# EasyEDA Pro project PCB.eprj

# Schematic Schematics
Create Date: 2023-04-09; Page Name: Schematic; Project Name: PCB; Schematic Name: Schematics; Update Date: 2023-04-09; Drawed: Keith Wong; Page Size: A4; Version: V1.0
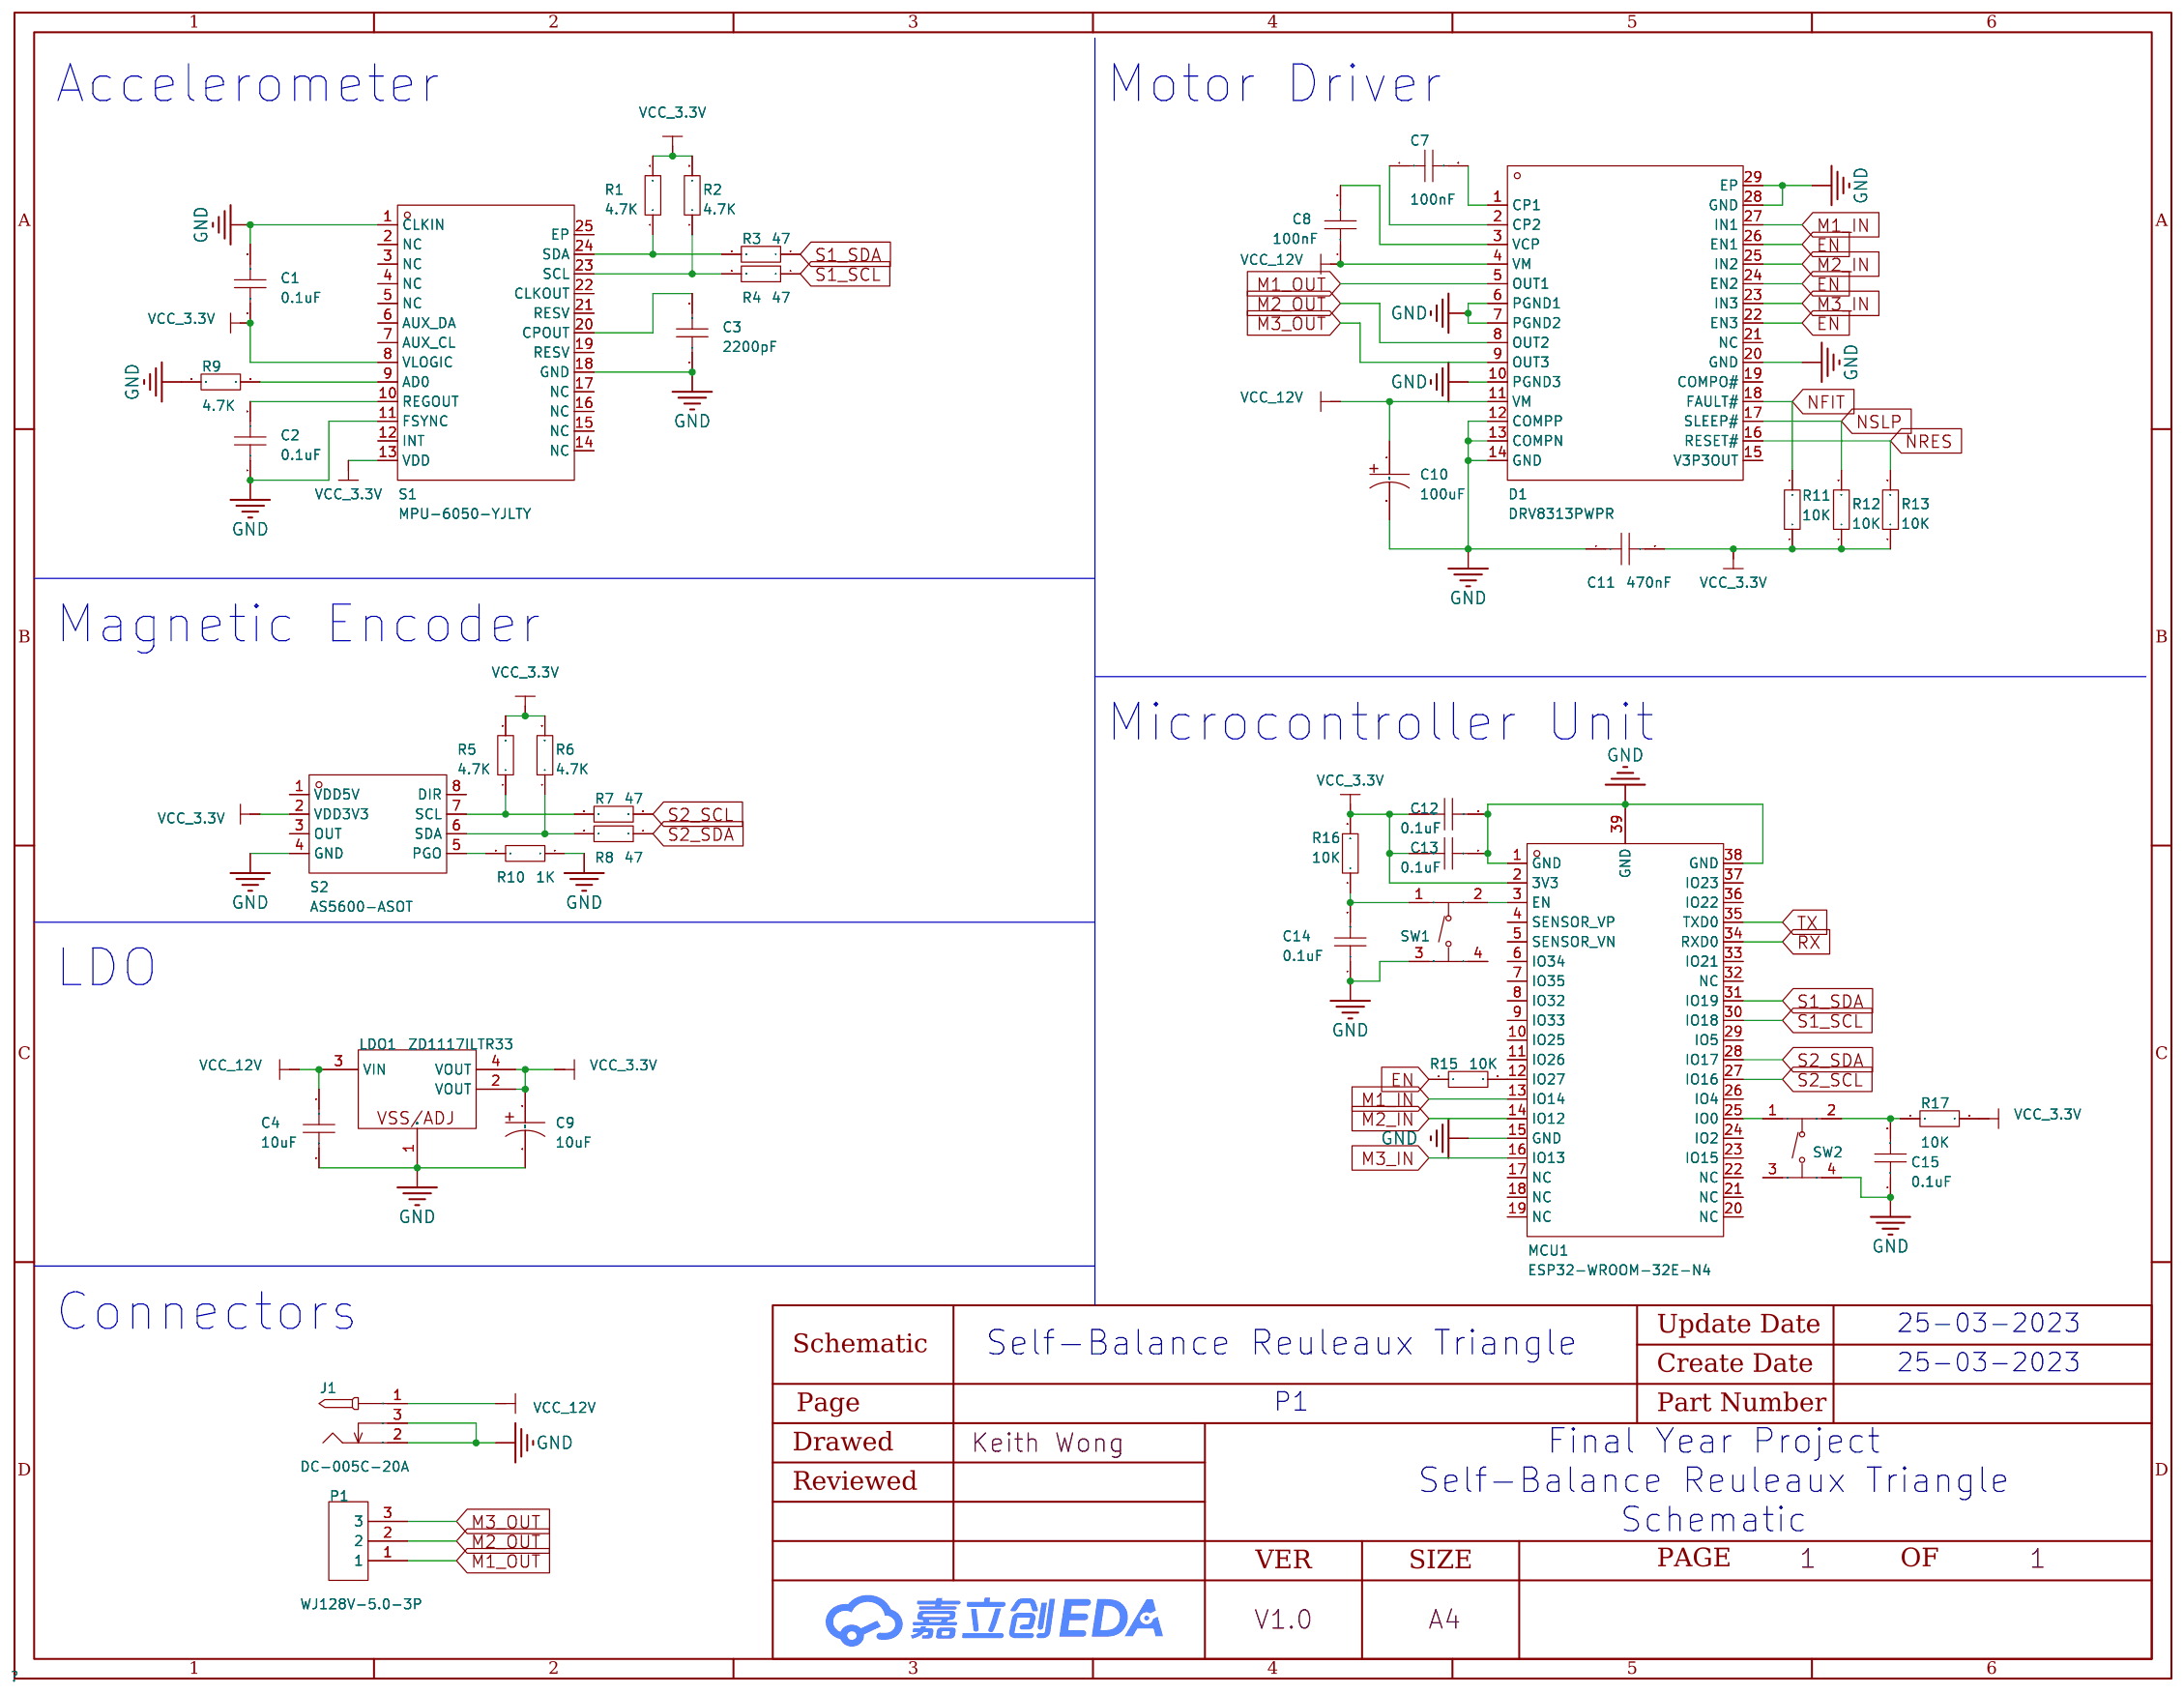
[diagram p0: schematic sheet]

## Parts
C1  0.1uF  [C0603]
C2  0.1uF  [C0603]
C3  2200pF  [C0603]
C4  10uF  [C0603]
C7  100nF  [C0603]
C8  100nF  [C0603]
C9  10uF  [CAP-SMD_BD6.3-L6.6-W6.6-FD]
C10  100uF  [CAP-SMD_BD6.3-L6.6-W6.6-FD]
C11  470nF  [C0603]
C12  0.1uF  [C0603]
C13  0.1uF  [C0603]
C14  0.1uF  [C0603]
C15  0.1uF  [C0603]
D1  DRV8313PWPR  [HTSSOP-28_L9.8-W4.5-P0.65-LS6.6-BL-EP]
J1  DC-005C-20A  [DC-IN-TH_DC-005C-20A]
LDO1  ZD1117ILTR33  [SOT-223-4_L6.5-W3.5-P2.30-LS7.0-BR]
MCU1  ESP32-WROOM-32E-N4  [WIFI-SMD_ESP32-WROOM-32E]
P1  WJ128V-5.0-3P  [CONN-TH_3P-P5.00_WJ128V-5.0-3P]
R1  4.7K  [R0603]
R2  4.7K  [R0603]
R3  47  [R0603]
R4  47  [R0603]
R5  4.7K  [R0603]
R6  4.7K  [R0603]
R7  47  [R0603]
R8  47  [R0603]
R9  4.7K  [R0603]
R10  1K  [R0603]
R11  10K  [R0603]
R12  10K  [R0603]
R13  10K  [R0603]
R15  10K  [R0603]
R16  10K  [R0603]
R17  10K  [R0603]
S1  MPU-6050-YJLTY  [QFN-24_L4.0-W4.0-P0.50-TL-EP2.7]
S2  AS5600-ASOT  [SOIC-8_L5.0-W4.0-P1.27-LS6.0-BL]
SW1  TS-1187A-B-A-B  [SW-SMD_4P-L5.1-W5.1-P3.70-LS6.5-TL-2]
SW2  TS-1187A-B-A-B  [SW-SMD_4P-L5.1-W5.1-P3.70-LS6.5-TL-2]

## Library data of the parts
C1-C4 C7 C8 C11-C15 = CAP_0603: Supplier Footprint: 0603
C9 C10 = 47uF-SMD,6.3*5.4mm: Supplier Part: C9900020202; JLCPCB Part Class: Extended Part; Datasheet: https://atta.szlcsc.comnull; Supplier: LCSC
D1 = DRV8313PWPR: DRV8313 三路 1/2 H 桥驱动器 IC; Supplier Part: C92482; Manufacturer: TI(德州仪器); Supplier Footprint: HTSSOP-28; JLCPCB Part Class: Extended Part; Datasheet: https://atta.szlcsc.com/upload/public/pdf/source/20180307/C92482_15204091381071407760.pdf; Supplier: LCSC
J1 = DC-005C-20A: 触点内径:2mm;触点外径:6.4mm;额定电流:3A;额定电压:24V;; LCSC Part Name: 内径:2mm 外径:6.4mm 高品质; Supplier Part: C84007; Manufacturer: 韩国韩荣; Supplier Footprint: 插件; JLCPCB Part Class: Extended Part; Datasheet: https://atta.szlcsc.com/upload/public/pdf/source/20210810/A9F07BBB960FE584CB8DE17AFB8953D7.pdf; Supplier: LCSC; Inside Contact Diameter: 2mm; Outside Contact Diameter: 6.4mm; Current Rating (Max): 3A; Voltage Rating (Max): 24V
LDO1 = ZD1117ILTR33: 输出类型:-;输出极性:正;输出通道数:1;最大输入电压:18V;输出电压:3.3V;压差:1.3V;静态电流(地电流):2mA;输出电流:1A;电源纹波抑制比(PSRR):-;噪声:-;特性:-;工作温度:-40℃~+85℃;; LCSC Part Name: 正 Vin=18V Vout=3.3V 1A; Supplier Part: C2928930; Manufacturer: Zetta(澜智); Supplier Footprint: SOT-223-4; JLCPCB Part Class: Extended Part; Datasheet: https://atta.szlcsc.com/upload/public/pdf/source/20211228/8A2F6B482059197F37036E6E4099FB94.pdf; Supplier: LCSC; Output Polarity: 正; Number of Outputs: 1; Maximum Input Voltage: 18V; Output Voltage: 3.3V; Dropout Voltage: 1.3V; Quiescent Current (Ground Current): 2mA; Output Current: 1A; Operating Temperature: -40℃~+85℃
MCU1 = ESP32-WROOM-32E-N4_C701341: ESP32-WROOM-32E 集成 ESP32-D0WD-V3 芯片，具有?高的稳定性和安全性能。; LCSC Part Name: WIFI模块 PCB板载天线模组; Supplier Part: C701341; Manufacturer: ESPRESSIF(乐鑫); Supplier Footprint: SMD,18x25.5mm; JLCPCB Part Class: Extended Part; Datasheet: https://atta.szlcsc.com/upload/public/pdf/source/20220601/0020821B65DE5740BBACA5FACC5CF3B6.pdf; Supplier: LCSC
P1 = WJ128V-5.0-3P: 间距:5mm;排数:1;每排PIN数:3;安装方式:直针;额定电流:20A;额定电压:250V;线规 - AWG:12~22;线规 - mm?:2.5;工作温度范围:-40℃~+105℃;颜色:绿色;; LCSC Part Name: 5mm 排数:1 每排P数:3 直针 可拼接; Supplier Part: C8270; Manufacturer: KANGNEX(康奈克斯电气); Supplier Footprint: 直插,P=5mm; JLCPCB Part Class: Extended Part; Datasheet: https://atta.szlcsc.com/upload/public/pdf/source/20191225/C8270_68EE597E4523D77F257225C74F324861.pdf; Supplier: LCSC; Pitch: 5mm; Number of Rows: 1; Number of PINs Per Row: 3; Mounting Style: 直针; Current Rating (Max): 20A; Voltage Rating (Max): 250V; Wire Gauge - AWG: 12~22; Wire Gauge - mm?: 2.5; Operating Temperature Range: -40℃~+105℃; Color: 绿色
R1-R13 R15-R17 = Res_0603: Supplier Footprint: 0603
S1 = MPU-6050-YJLTY: Supplier Part: C9900004367; Supplier Footprint: QFN-24_L4.0-W4.0-P0.50-EP2.7; JLCPCB Part Class: Extended Part; Supplier: LCSC
S2 = AS5600-ASOT: Supplier Part: C499458; Manufacturer: ams(艾迈斯半导体); Supplier Footprint: SOIC-8; JLCPCB Part Class: Extended Part; Datasheet: https://atta.szlcsc.com/upload/public/pdf/source/20200324/C499458_E1461AFB0CE1042DE5756821C534625C.pdf; Supplier: LCSC
SW1 SW2 = TS-1187A-B-A-B: 触点电流:50mA;额定电压(DC):12V;绝缘电阻:100mΩ;电路结构:单刀单掷;安装方式:立贴;按钮形状:圆形按钮;按钮/盖帽颜色:金色;带灯:无;作用力:160gf;机械寿命:100000;工作温度:-30℃~+85℃;开关长度:5.1mm;开关宽度:5.1mm;开关高度:1.5mm;带支架:无;; LCSC Part Name: 轻触开关 5.1*5.1*1.5贴片 防水金属头160gf; Supplier Part: C318884; Manufacturer: XKB Connectivity(中国星坤); Supplier Footprint: SMD; JLCPCB Part Class: Basic Part; Datasheet: https://atta.szlcsc.com/upload/public/pdf/source/20200227/C318884_1F20165719E1C4CAA3E10C4C359C6E26.pdf; Supplier: LCSC; Contact Current: 50mA; Voltage Rating (DC): 12V; Insulation Resistance: 100mΩ; Circuit: 单刀单掷; Mounting Style: 立贴; Actuator Style: 圆形按钮; Actuator/Cap Color: 金色; With Lamp: 无; Operating Force: 160gf; Mechanical Life: 100000; Operating Temperature: -30℃~+85℃; Switch Length: 5.1mm; Switch Width: 5.1mm; Switch Height: 1.5mm; Strike Gundam: 无

## Nets
GND: C1.2 C2.1 C3.1 C4.2 C9.2 C10.2 C11.1 C12.2 C13.2 C14.1 C15.1 D1.6(PGND1) D1.7(PGND2) D1.10(PGND3) D1.12(COMPP) D1.13(COMPN) D1.14(GND) D1.20(GND) D1.28(GND) D1.29(EP) J1.2 J1.3 LDO1.1(VSS/ADJ) MCU1.1(GND) MCU1.15(GND) MCU1.38(GND) MCU1.39(GND) R9.1 R10.1 S1.1(CLKIN) S1.11(FSYNC) S1.18(GND) S2.4(GND) SW1.3(C) SW2.4(D)
VCC_3.3V: C1.1 C9.1 C11.2 C12.1 C13.1 LDO1.2(VOUT) LDO1.4(VOUT) MCU1.2(3V3) R1.2 R2.2 R5.2 R6.2 R11.1 R12.1 R13.1 R16.2 R17.2 S1.8(VLOGIC) S1.13(VDD) S2.2(VDD3V3)
VCC_12V: C4.1 C8.1 C10.1 D1.4(VM) D1.11(VM) J1.1 LDO1.3(VIN)
EN: D1.22(EN3) D1.24(EN2) D1.26(EN1) R15.1
M1_IN: D1.27(IN1) MCU1.13(IO14)
M1_OUT: D1.5(OUT1) P1.1
M2_IN: D1.25(IN2) MCU1.14(IO12)
M2_OUT: D1.8(OUT2) P1.2
M3_IN: D1.23(IN3) MCU1.16(IO13)
M3_OUT: D1.9(OUT3) P1.3
NFIT: D1.18(FAULT#) R11.2
NRES: D1.16(RESET#) R13.2
NSLP: D1.17(SLEEP#) R12.2
RX: MCU1.34(RXD0)
S1_SCL: MCU1.30(IO18) R4.1
S1_SDA: MCU1.31(IO19) R3.1
S2_SCL: MCU1.27(IO16) R7.1
S2_SDA: MCU1.28(IO17) R8.1
TX: MCU1.35(TXD0)
$1N1534: R5.1 R7.2 S2.7(SCL)
$1N1538: R6.1 R8.2 S2.6(SDA)
$1N2187: R10.2 S2.5(PGO)
$1N2532: C7.2 D1.1(CP1)
$1N2537: C7.1 D1.2(CP2)
$1N2541: C8.2 D1.3(VCP)
$1N3829: MCU1.12(IO27) R15.2
$1N3990: MCU1.3(EN) SW1.2(B)
$1N4114: C14.2 R16.1 SW1.1(A)
$1N4239: C15.2 R17.1 SW2.2(B)
$1N4243: MCU1.25(IO0) SW2.1(A)
Net-(C2-2): C2.2 S1.10(REGOUT)
Net-(C3-2): C3.2 S1.20(CPOUT)
Net-(R1-1): R1.1 R3.2 S1.24(SDA)
Net-(R2-1): R2.1 R4.2 S1.23(SCL)
Net-(R9-2): R9.2 S1.9(AD0)

Not connected (* = marked no-connect by the designer): D1 15(V3P3OUT) 19(COMPO#) 21(NC); MCU1 4(SENSOR_VP) 5(SENSOR_VN) 6(IO34) 7(IO35) 8(IO32) 9(IO33) 10(IO25) 11(IO26) 17(NC) 18(NC) 19(NC) 20(NC) 21(NC) 22(NC) 23(IO15) 24(IO2) 26(IO4) 29(IO5) 32(NC) 33(IO21) 36(IO22) 37(IO23); S1 2(NC) 3(NC) 4(NC) 5(NC) 6(AUX_DA) 7(AUX_CL) 12(INT) 14(NC) 15(NC) 16(NC) 17(NC) 19(RESV) 21(RESV) 22(CLKOUT) 25(EP); S2 1(VDD5V) 3(OUT) 8(DIR); SW1 4(D); SW2 3(C)

## Notes on the sheet
- Accelerometer
- Motor Driver
- Magnetic Encoder
- Microcontroller Unit
- LDO
- Connectors
- 25-03-2023
- Self-Balance Reuleaux Triangle
- 25-03-2023
- P1
- Final Year Project
- Self-Balance Reuleaux Triangle
- Schematic

# Board PCB
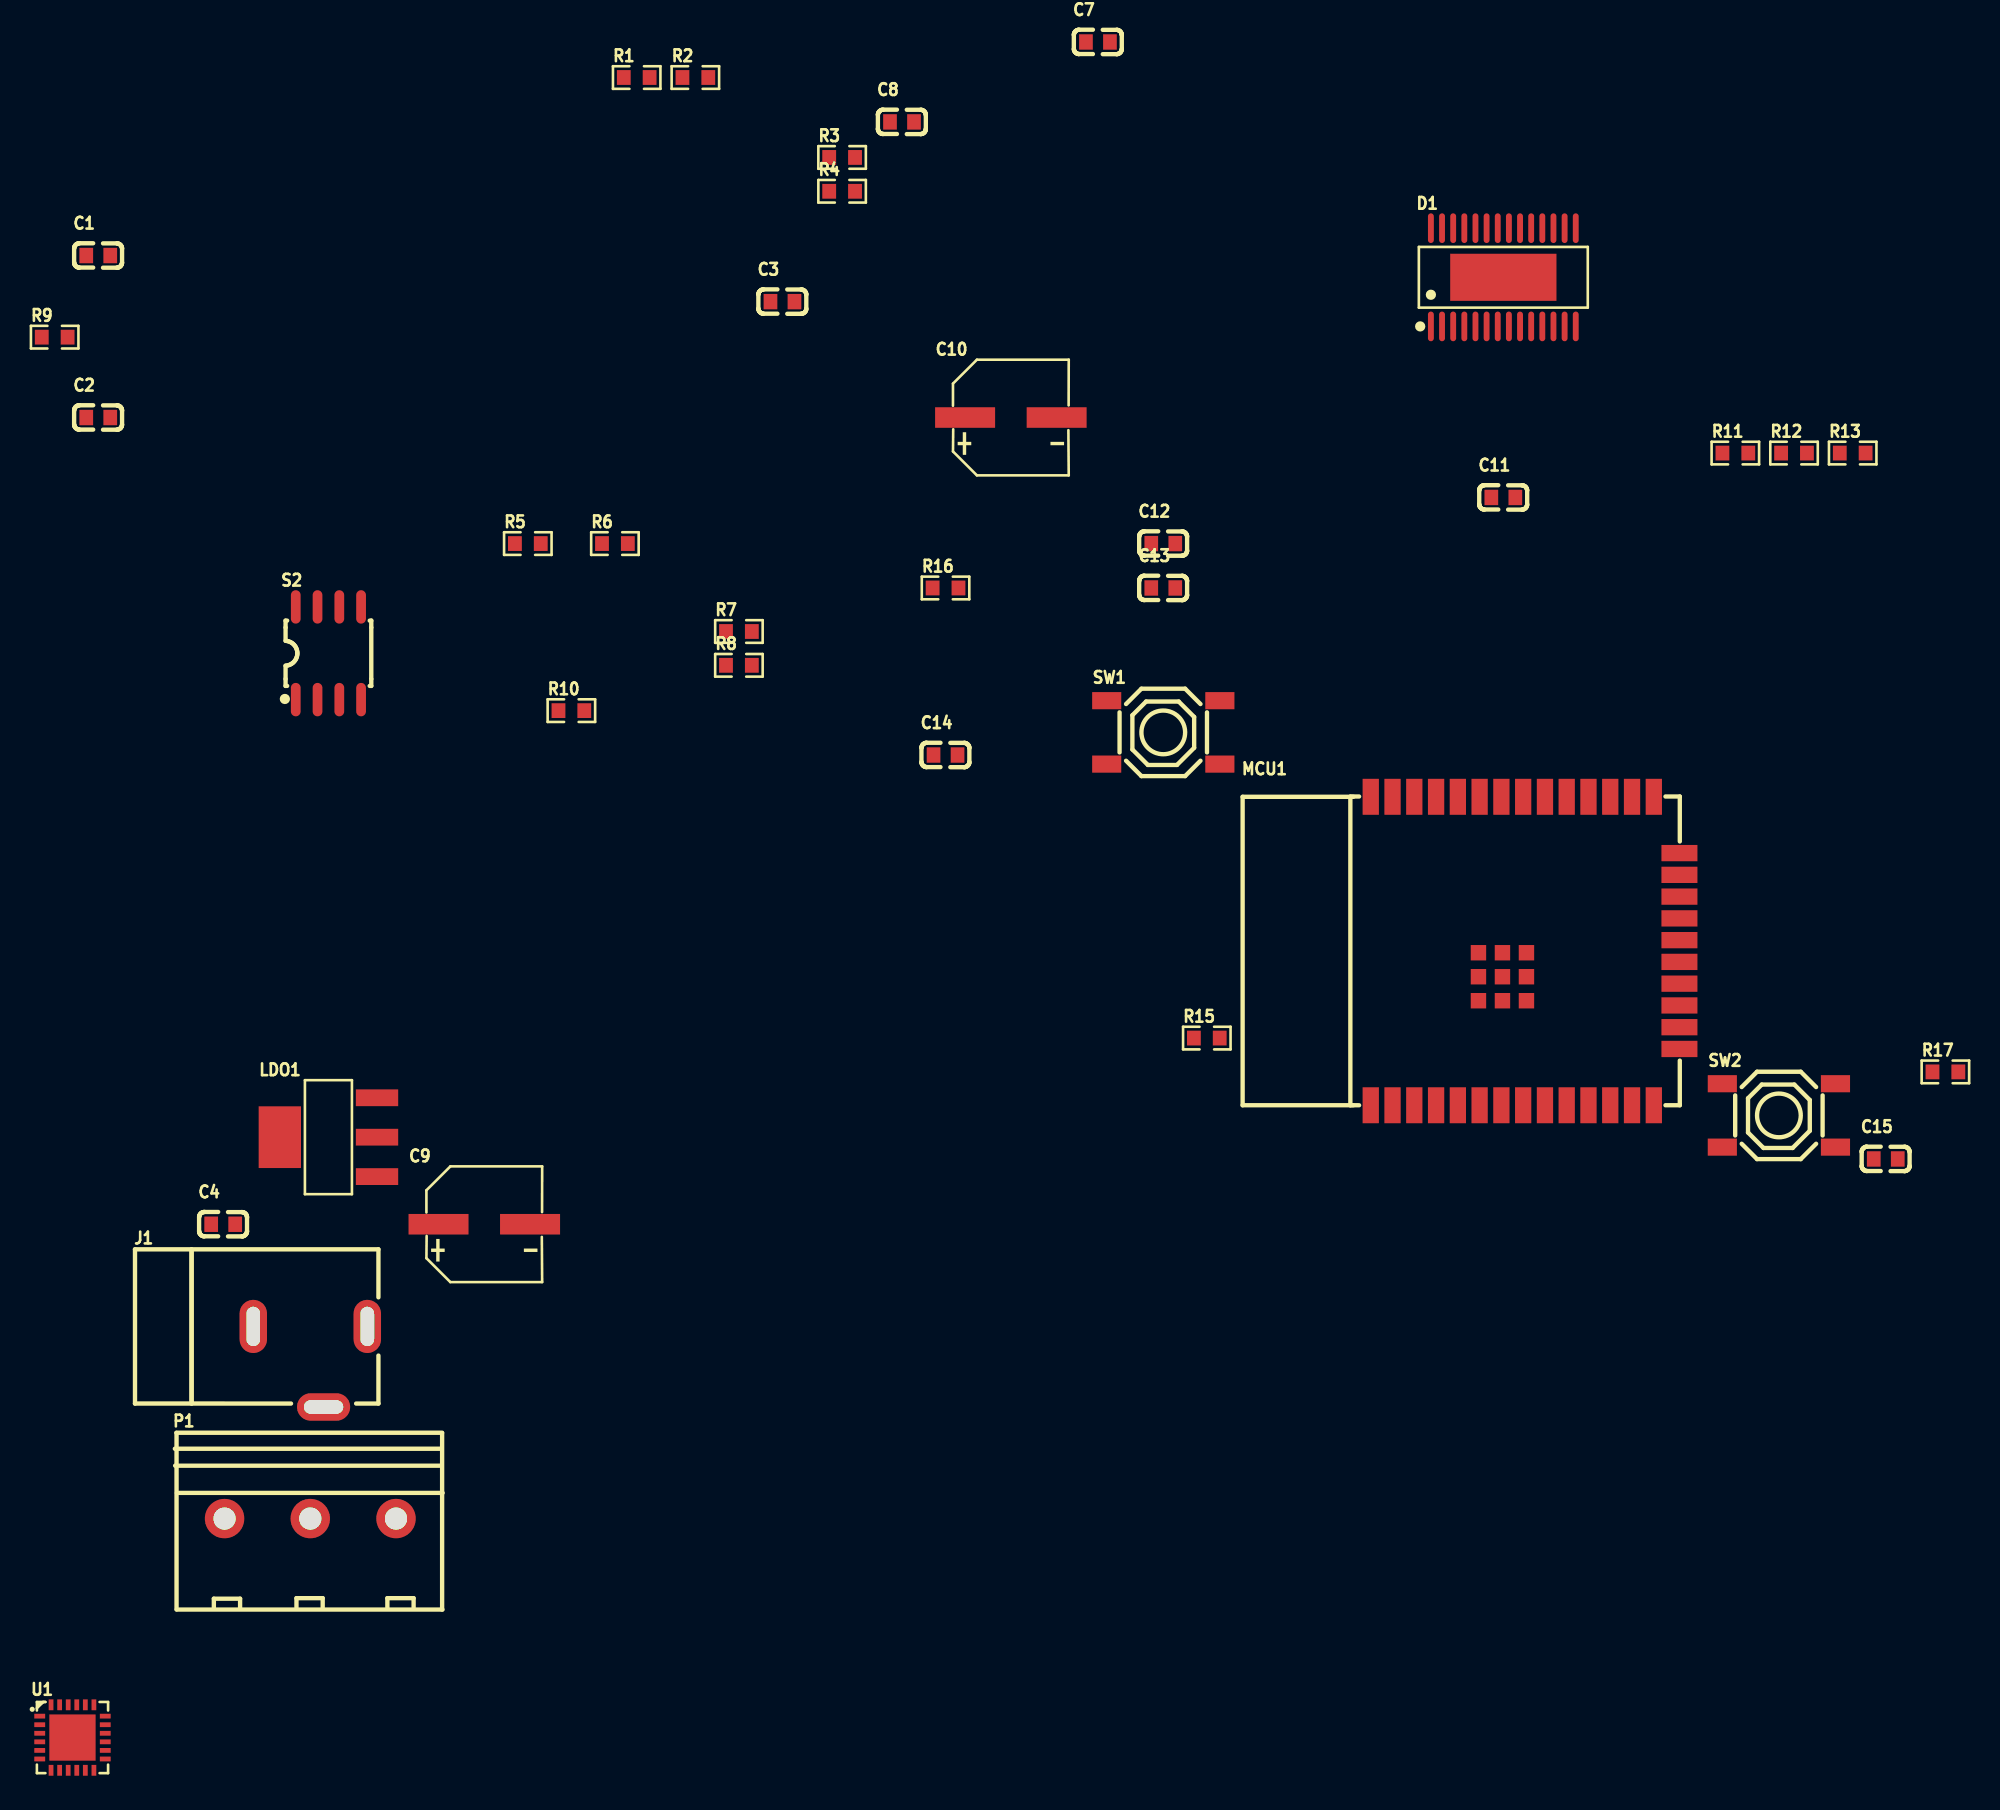
[diagram p1: board, top side]
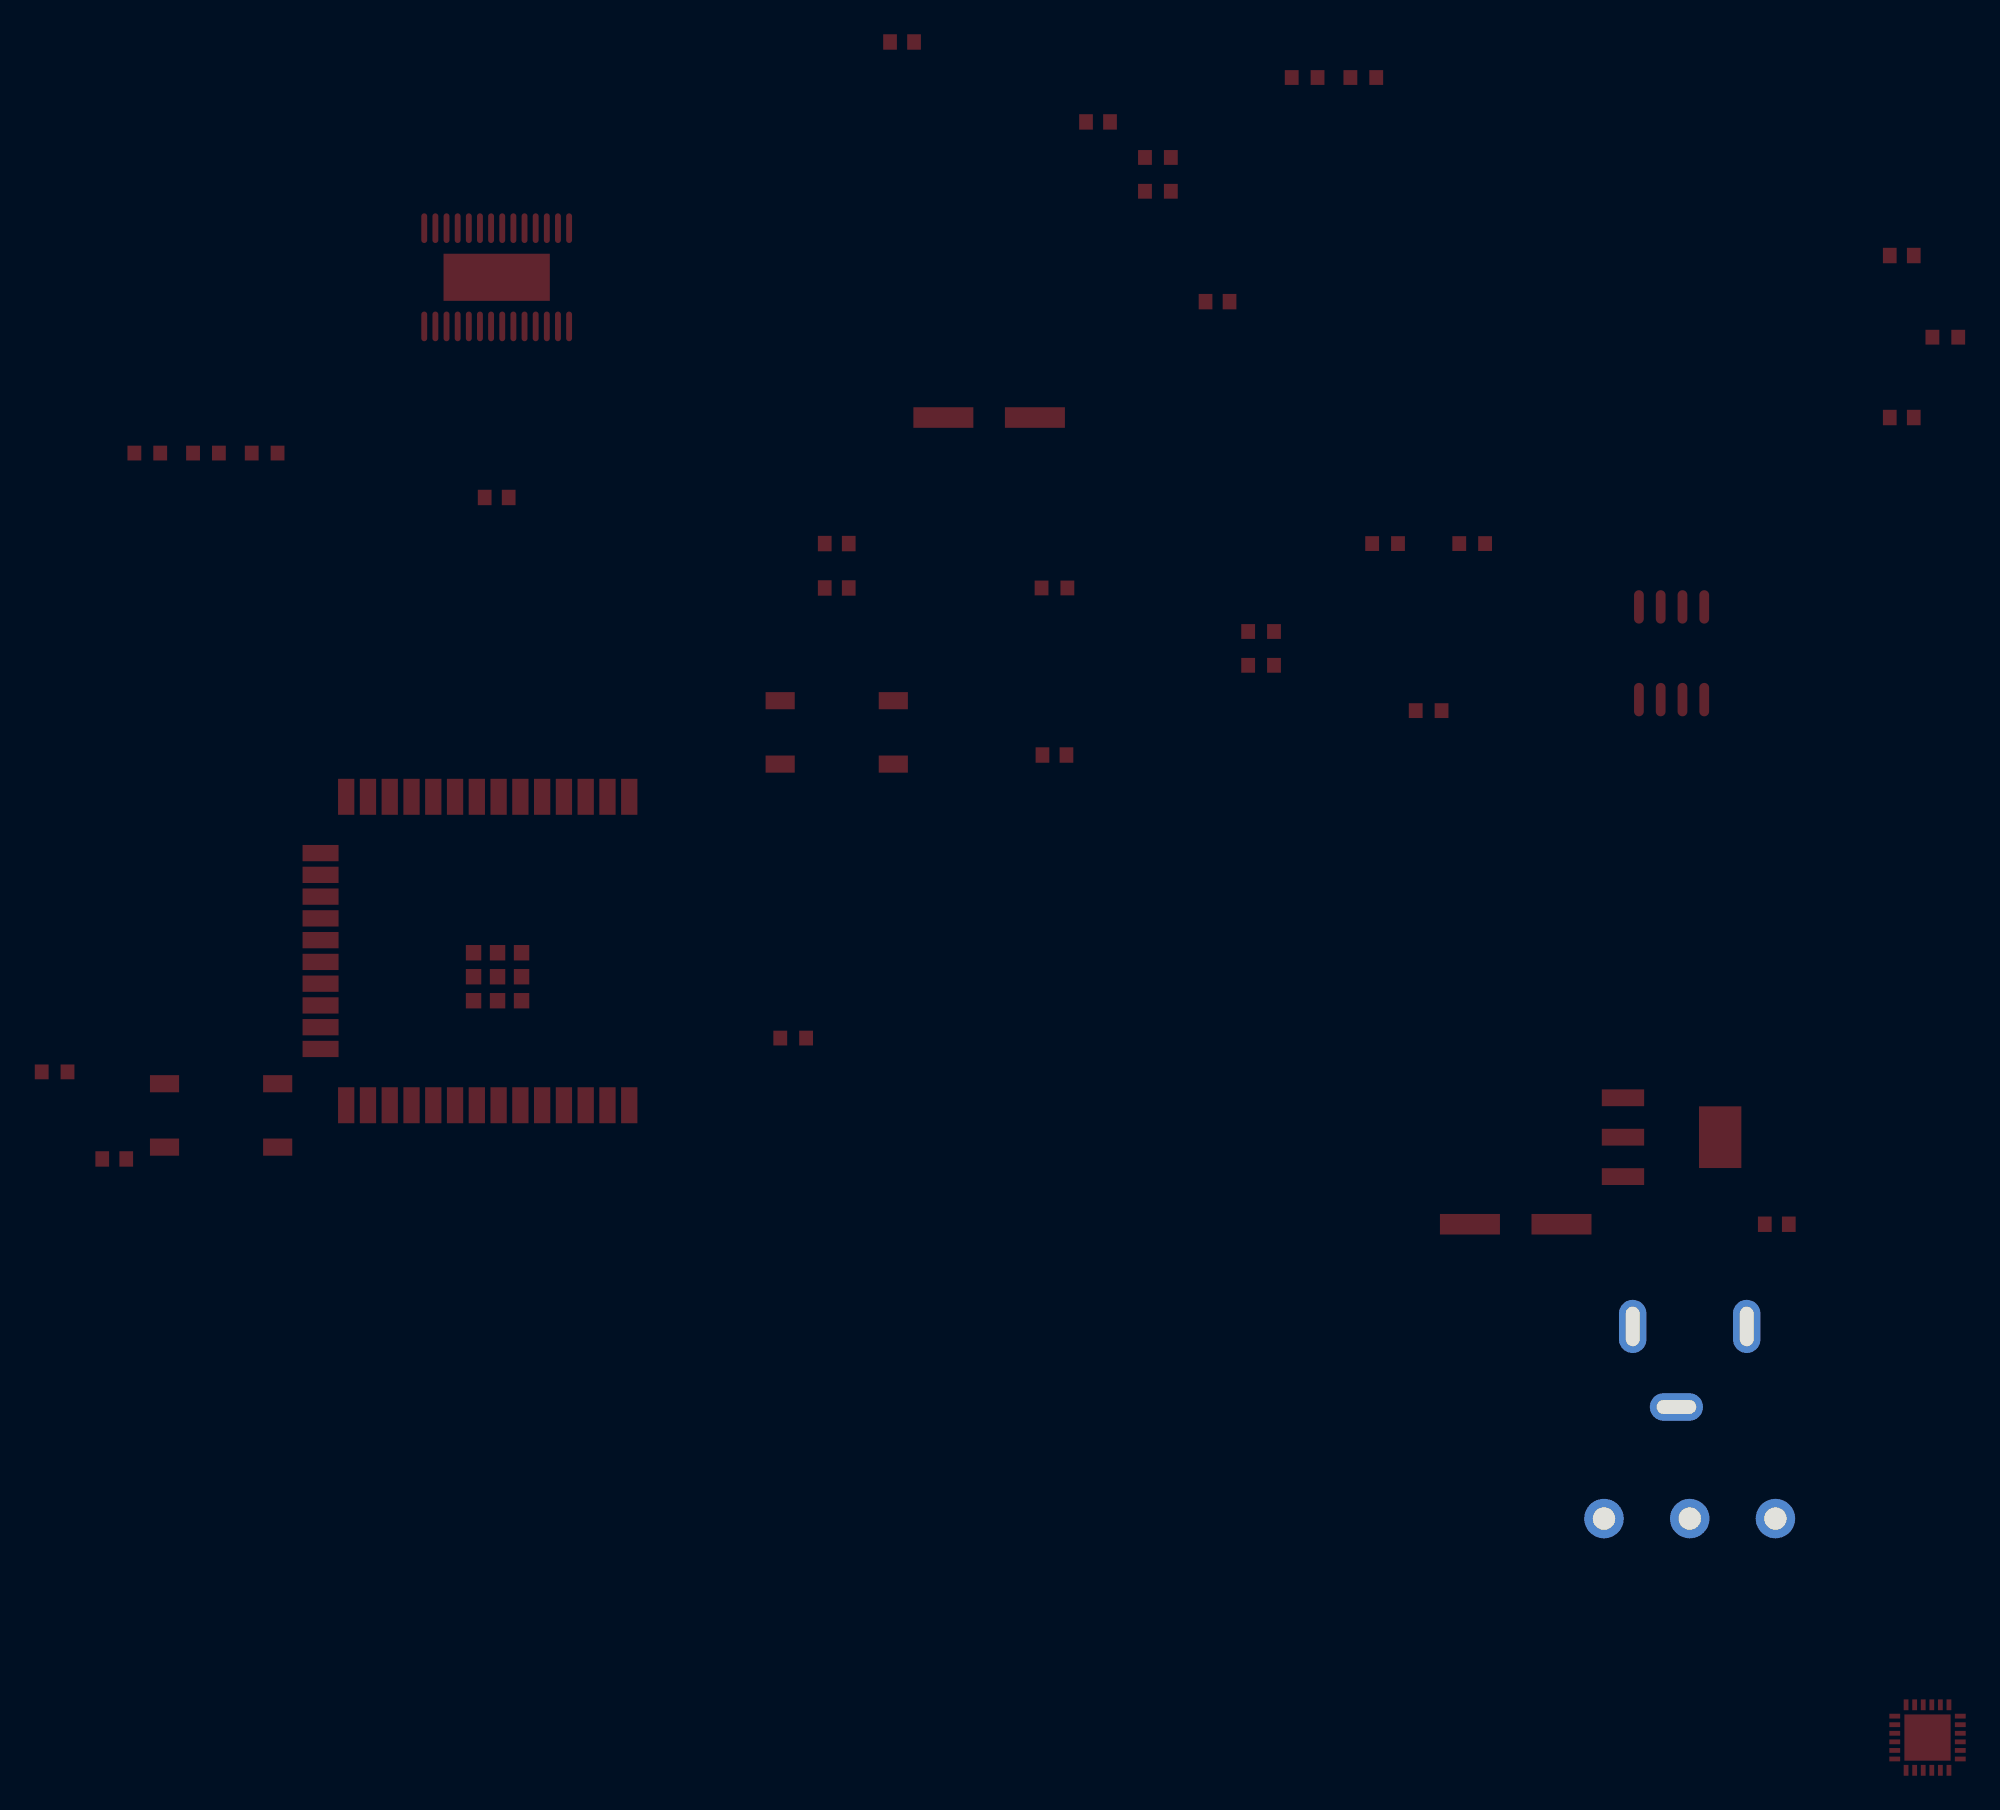
[diagram p2: board, bottom side, seen from below]

No outline. copper layers: Top Layer, Bottom Layer. Coordinates in mm from the lowest, leftmost part position.
Stack: Top Layer 0.035mm / Dielectric1 1.51mm FR4 er 4.5 / Bottom Layer 0.035mm

## Design rules (mm)
template: JLCPCB Capability(Two Layers Board)
spacing copperThickness1oz (default): track to track 0.102, other pairs 0.152 to 0.3
spacing copperThickness2oz: track to track 0.203, other pairs 0.152 to 0.3
track width copperThickness1oz (default): min 0.127, default 0.254, max 2.54
track width copperThickness2oz: min 0.203, default 0.254, max 2.54
differential pair differentialPair (default): width min 0.127, default 0.254, max 2.54; gap min 0.152, default 0.152
via viaSize (default): diameter min 0.5, default 0.61, max 10; hole min 0.3, default 0.305, max 6.3

## Placement (name value [footprint] x y rotation side)
C1  0.1uF  [C0603]  2.54 86.49 0 top
C2  0.1uF  [C0603]  2.54 77.03 0 top
C3  2200pF  [C0603]  42.45 83.8 0 top
C4  10uF  [C0603]  9.83 29.96 0 top
C7  100nF  [C0603]  60.85 98.95 0 top
C8  100nF  [C0603]  49.42 94.28 0 top
C9  10uF  [CAP-SMD_BD6.3-L6.6-W6.6-FD]  25.06 29.96 0 top
C10  100uF  [CAP-SMD_BD6.3-L6.6-W6.6-FD]  55.77 77.03 0 top
C11  470nF  [C0603]  84.5 72.37 0 top
C12  0.1uF  [C0603]  64.66 69.68 0 top
C13  0.1uF  [C0603]  64.66 67.09 0 top
C14  0.1uF  [C0603]  51.96 57.34 0 top
C15  0.1uF  [C0603]  106.81 33.77 0 top
D1  DRV8313PWPR  [HTSSOP-28_L9.8-W4.5-P0.65-LS6.6-BL-EP]  84.5 85.22 0 top
J1  DC-005C-20A  [DC-IN-TH_DC-005C-20A]  14.91 21.64 0 top
LDO1  ZD1117ILTR33  [SOT-223-4_L6.5-W3.5-P2.30-LS7.0-BR]  15.97 35.04 0 top
MCU1  ESP32-WROOM-32E-N4  [WIFI-SMD_ESP32-WROOM-32E]  85.77 45.9 0 top
P1  WJ128V-5.0-3P  [CONN-TH_3P-P5.00_WJ128V-5.0-3P]  14.91 12.78 0 top
R1  4.7K  [R0603]  33.95 96.87 0 top
R2  4.7K  [R0603]  37.37 96.87 0 top
R3  47  [R0603]  45.93 92.21 0 top
R4  47  [R0603]  45.93 90.24 0 top
R5  4.7K  [R0603]  27.6 69.68 0 top
R6  4.7K  [R0603]  32.68 69.68 0 top
R7  47  [R0603]  39.91 64.55 0 top
R8  47  [R0603]  39.91 62.57 0 top
R9  4.7K  [R0603]  0 81.72 0 top
R10  1K  [R0603]  30.14 59.93 0 top
R11  10K  [R0603]  98.03 74.96 0 top
R12  10K  [R0603]  101.45 74.96 0 top
R13  10K  [R0603]  104.88 74.96 0 top
R15  10K  [R0603]  67.2 40.82 0 top
R16  10K  [R0603]  51.96 67.09 0 top
R17  10K  [R0603]  110.28 38.85 0 top
S2  AS5600-ASOT  [SOIC-8_L5.0-W4.0-P1.27-LS6.0-BL]  15.97 63.28 0 top
SW1  TS-1187A-B-A-B  [SW-SMD_4P-L5.1-W5.1-P3.70-LS6.5-TL-2]  64.66 58.66 0 top
SW2  TS-1187A-B-A-B  [SW-SMD_4P-L5.1-W5.1-P3.70-LS6.5-TL-2]  100.57 36.31 0 top
U1  MPU-6050-YJLTY  [QFN-24_L4.0-W4.0-P0.50-TL-EP2.7]  1.04 0 0 top

## Footprints (pads in the part's own frame, mm; a bottom-side part is the same pattern mirrored in y, then rotated)
C0603
  rect 0.8x0.9 smd: 1(-0.7,0) 2(0.7,0)
CAP-SMD_BD6.3-L6.6-W6.6-FD
  rect 3.5x1.2 smd: 1(-2.67,0) 2(2.67,0)
CONN-TH_3P-P5.00_WJ128V-5.0-3P
  round 2.3 hole 1.3: 1(-5,0) 2(-0.002,0) 3(5,0)
DC-IN-TH_DC-005C-20A
  oval 1.6x3.1 hole 0.8x2.3: 1(3.325,2.35) 2(-3.325,2.35)
  oval 3.1x1.6 hole 2.3x0.8: 3(0.775,-2.35)
HTSSOP-28_L9.8-W4.5-P0.65-LS6.6-BL-EP
  oval 0.343x1.732 smd: 1(-4.225,-2.866) 2(-3.575,-2.866) 3(-2.925,-2.866) 4(-2.275,-2.866) 5(-1.625,-2.866) 6(-0.975,-2.866) 7(-0.325,-2.866) 8(0.325,-2.866) 9(0.975,-2.866) 10(1.625,-2.866) 11(2.275,-2.866) 12(2.925,-2.866) 13(3.575,-2.866) 14(4.225,-2.866) 15(4.225,2.866) 16(3.575,2.866) 17(2.925,2.866) 18(2.275,2.866) 19(1.625,2.866) 20(0.975,2.866) 21(0.325,2.866) 22(-0.325,2.866) 23(-0.975,2.866) 24(-1.625,2.866) 25(-2.275,2.866) 26(-2.925,2.866) 27(-3.575,2.866) 28(-4.225,2.866)
  rect 6.2x2.75 smd: 29(0,0)
QFN-24_L4.0-W4.0-P0.50-TL-EP2.7
  rect 0.633x0.28 smd: 1(-1.911,1.25) 2(-1.911,0.75) 3(-1.911,0.25) 4(-1.911,-0.25) 5(-1.911,-0.75) 6(-1.911,-1.25) 13(1.911,-1.25) 14(1.911,-0.75) 15(1.911,-0.25) 16(1.911,0.25) 17(1.911,0.75) 18(1.911,1.25)
  rect 0.28x0.633 smd: 7(-1.25,-1.911) 8(-0.75,-1.911) 9(-0.25,-1.911) 10(0.25,-1.911) 11(0.75,-1.911) 12(1.25,-1.911) 19(1.25,1.911) 20(0.75,1.911) 21(0.25,1.911) 22(-0.25,1.911) 23(-0.75,1.911) 24(-1.25,1.911)
  rect 2.7x2.7 smd: 25(0,0)
R0603
  rect 0.806x0.864 smd: 1(-0.753,0) 2(0.753,0)
SOIC-8_L5.0-W4.0-P1.27-LS6.0-BL
  oval 0.569x1.95 smd: 1(-1.905,-2.705) 2(-0.635,-2.705) 3(0.635,-2.705) 4(1.905,-2.705) 5(1.905,2.705) 6(0.635,2.705) 7(-0.635,2.705) 8(-1.905,2.705)
SOT-223-4_L6.5-W3.5-P2.30-LS7.0-BR
  rect 2.47x0.98 smd: 1(2.835,-2.3) 2(2.835,0) 3(2.835,2.3)
  rect 2.47x3.6 smd: 4(-2.835,0)
SW-SMD_4P-L5.1-W5.1-P3.70-LS6.5-TL-2
  rect 1.7x1 smd: 1(-3.3,1.85) 2(3.3,1.85) 3(-3.3,-1.85) 4(3.3,-1.85)
WIFI-SMD_ESP32-WROOM-32E
  rect 0.95x2.1 smd: 1(-9.002,-9) 2(-7.732,-9) 3(-6.463,-9) 4(-5.192,-9) 5(-3.922,-9) 6(-2.652,-9) 7(-1.383,-9) 8(-0.113,-9) 9(1.157,-9) 10(2.428,-9) 11(3.697,-9) 12(4.968,-9) 13(6.237,-9) 14(7.508,-9) 25(7.508,9) 26(6.237,9) 27(4.968,9) 28(3.697,9) 29(2.428,9) 30(1.157,9) 31(-0.113,9) 32(-1.383,9) 33(-2.652,9) 34(-3.922,9) 35(-5.192,9) 36(-6.463,9) 37(-7.732,9) 38(-9.002,9)
  rect 2.1x0.95 smd: 15(9.002,-5.715) 16(9.002,-4.445) 17(9.002,-3.175) 18(9.002,-1.905) 19(9.002,-0.635) 20(9.002,0.635) 21(9.002,1.905) 22(9.002,3.175) 23(9.002,4.445) 24(9.002,5.715)
  rect 0.9x0.9 smd: 39(-2.721,-0.1) 39(-2.721,-1.5) 39(-2.721,-2.9) 39(-1.321,-0.1) 39(-1.321,-1.5) 39(-1.321,-2.9) 39(0.079,-0.1) 39(0.079,-1.5) 39(0.079,-2.9)

## Nets
As in the schematic, except:
GND: C1.2 C2.1 C3.1 C4.2 C9.2 C10.2 C11.1 C12.2 C13.2 C14.1 C15.1 D1.6 D1.7 D1.10 D1.12 D1.13 D1.14 D1.20 D1.28 D1.29 J1.2 J1.3 LDO1.1 MCU1.1 MCU1.15 MCU1.38 MCU1.39 R9.1 R10.1 S2.4 SW1.3 SW2.4 U1.1 U1.11 U1.18
VCC_3.3V: C1.1 C9.1 C11.2 C12.1 C13.1 LDO1.2 LDO1.4 MCU1.2 R1.2 R2.2 R5.2 R6.2 R11.1 R12.1 R13.1 R16.2 R17.2 S2.2 U1.8 U1.13
$1N923: C2.2 U1.10
$1N1669: R9.2 U1.9
$1N4992: R1.1 R3.2 U1.24
$1N4995: R2.1 R4.2 U1.23
$1N5008: C3.2 U1.20

Pads without a net: D1 15 19 21; MCU1 4 5 6 7 8 9 10 11 17 18 19 20 21 22 23 24 26 29 32 33 36 37; S2 1 3 8; SW1 4; SW2 3; U1 2 3 4 5 6 7 12 14 15 16 17 19 21 22 25
